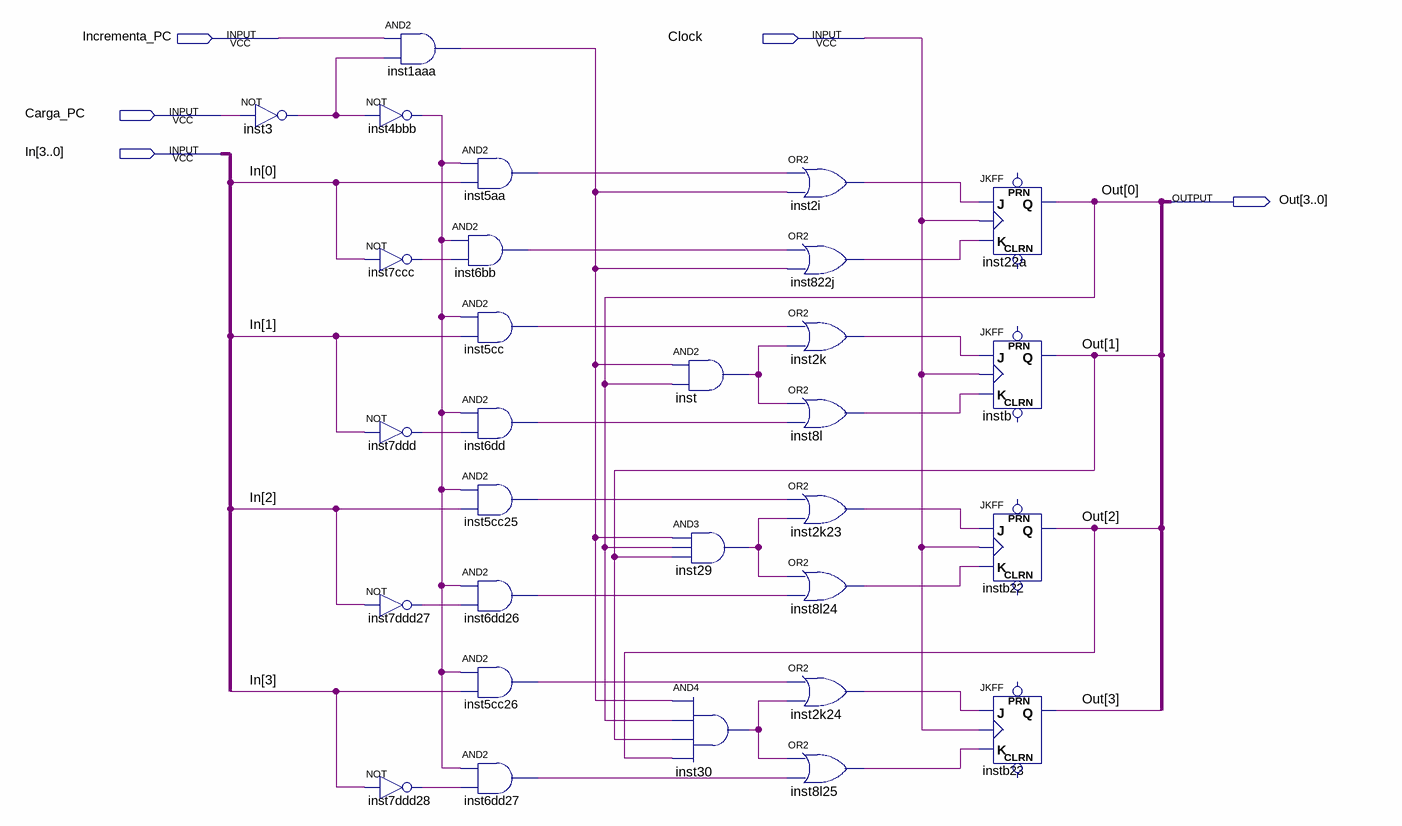
[diagram p0: schematic sheet]
// Quartus schematic PC.bdf as structural Verilog: 30 symbols, 5 pins
module PC (
  input  Incrementa_PC,
  input  Clock,
  input  Carga_PC,
  input  [3:0] In,
  output [3:0] Out
);

  wire inst1aaa_out, inst2i_out, inst2k23_out, inst2k24_out, inst2k_out, inst3_out, inst4bbb_out,
       inst5aa_out, inst5cc25_out, inst5cc26_out, inst5cc_out, inst6bb_out, inst6dd26_out, inst6dd27_out,
       inst6dd_out, inst7ccc_out, inst7ddd27_out, inst7ddd28_out, inst7ddd_out, inst8l24_out, inst8l25_out,
       inst8l_out, inst29_out, inst30_out, inst822j_out, inst_out;

  not inst3 (inst3_out, Carga_PC);
  and inst1aaa (inst1aaa_out, Incrementa_PC, inst3_out);
  not inst4bbb (inst4bbb_out, inst3_out);
  not inst7ccc (inst7ccc_out, In[0]);
  not inst7ddd (inst7ddd_out, In[1]);
  not inst7ddd27 (inst7ddd27_out, In[2]);
  not inst7ddd28 (inst7ddd28_out, In[3]);
  and inst5aa (inst5aa_out, inst4bbb_out, In[0]);
  and inst6bb (inst6bb_out, inst4bbb_out, inst7ccc_out);
  and inst5cc (inst5cc_out, inst4bbb_out, In[1]);
  and inst6dd (inst6dd_out, inst4bbb_out, inst7ddd_out);
  and inst5cc25 (inst5cc25_out, inst4bbb_out, In[2]);
  and inst6dd26 (inst6dd26_out, inst4bbb_out, inst7ddd27_out);
  and inst5cc26 (inst5cc26_out, inst4bbb_out, In[3]);
  and inst6dd27 (inst6dd27_out, inst4bbb_out, inst7ddd28_out);
  and inst (inst_out, inst1aaa_out, Out[0]);
  and inst29 (inst29_out, inst1aaa_out, Out[0], Out[1]);
  and inst30 (inst30_out, inst1aaa_out, Out[0], Out[1], Out[2]);
  or inst2i (inst2i_out, inst5aa_out, inst1aaa_out);
  or inst822j (inst822j_out, inst6bb_out, inst1aaa_out);
  or inst2k (inst2k_out, inst5cc_out, inst_out);
  or inst8l (inst8l_out, inst_out, inst6dd_out);
  or inst2k23 (inst2k23_out, inst5cc25_out, inst29_out);
  or inst8l24 (inst8l24_out, inst29_out, inst6dd26_out);
  or inst2k24 (inst2k24_out, inst5cc26_out, inst30_out);
  or inst8l25 (inst8l25_out, inst30_out, inst6dd27_out);
  JKFF inst22a (.K(inst822j_out), .J(inst2i_out), .CLK(Clock), .Q(Out[0]));  // open: PRN, CLRN
  JKFF instb (.K(inst8l_out), .J(inst2k_out), .CLK(Clock), .Q(Out[1]));  // open: PRN, CLRN
  JKFF instb22 (.K(inst8l24_out), .J(inst2k23_out), .CLK(Clock), .Q(Out[2]));  // open: PRN, CLRN
  JKFF instb23 (.K(inst8l25_out), .J(inst2k24_out), .CLK(Clock), .Q(Out[3]));  // open: PRN, CLRN
endmodule
